# Altium project AUDIO_FM_LC_00.PrjPcb
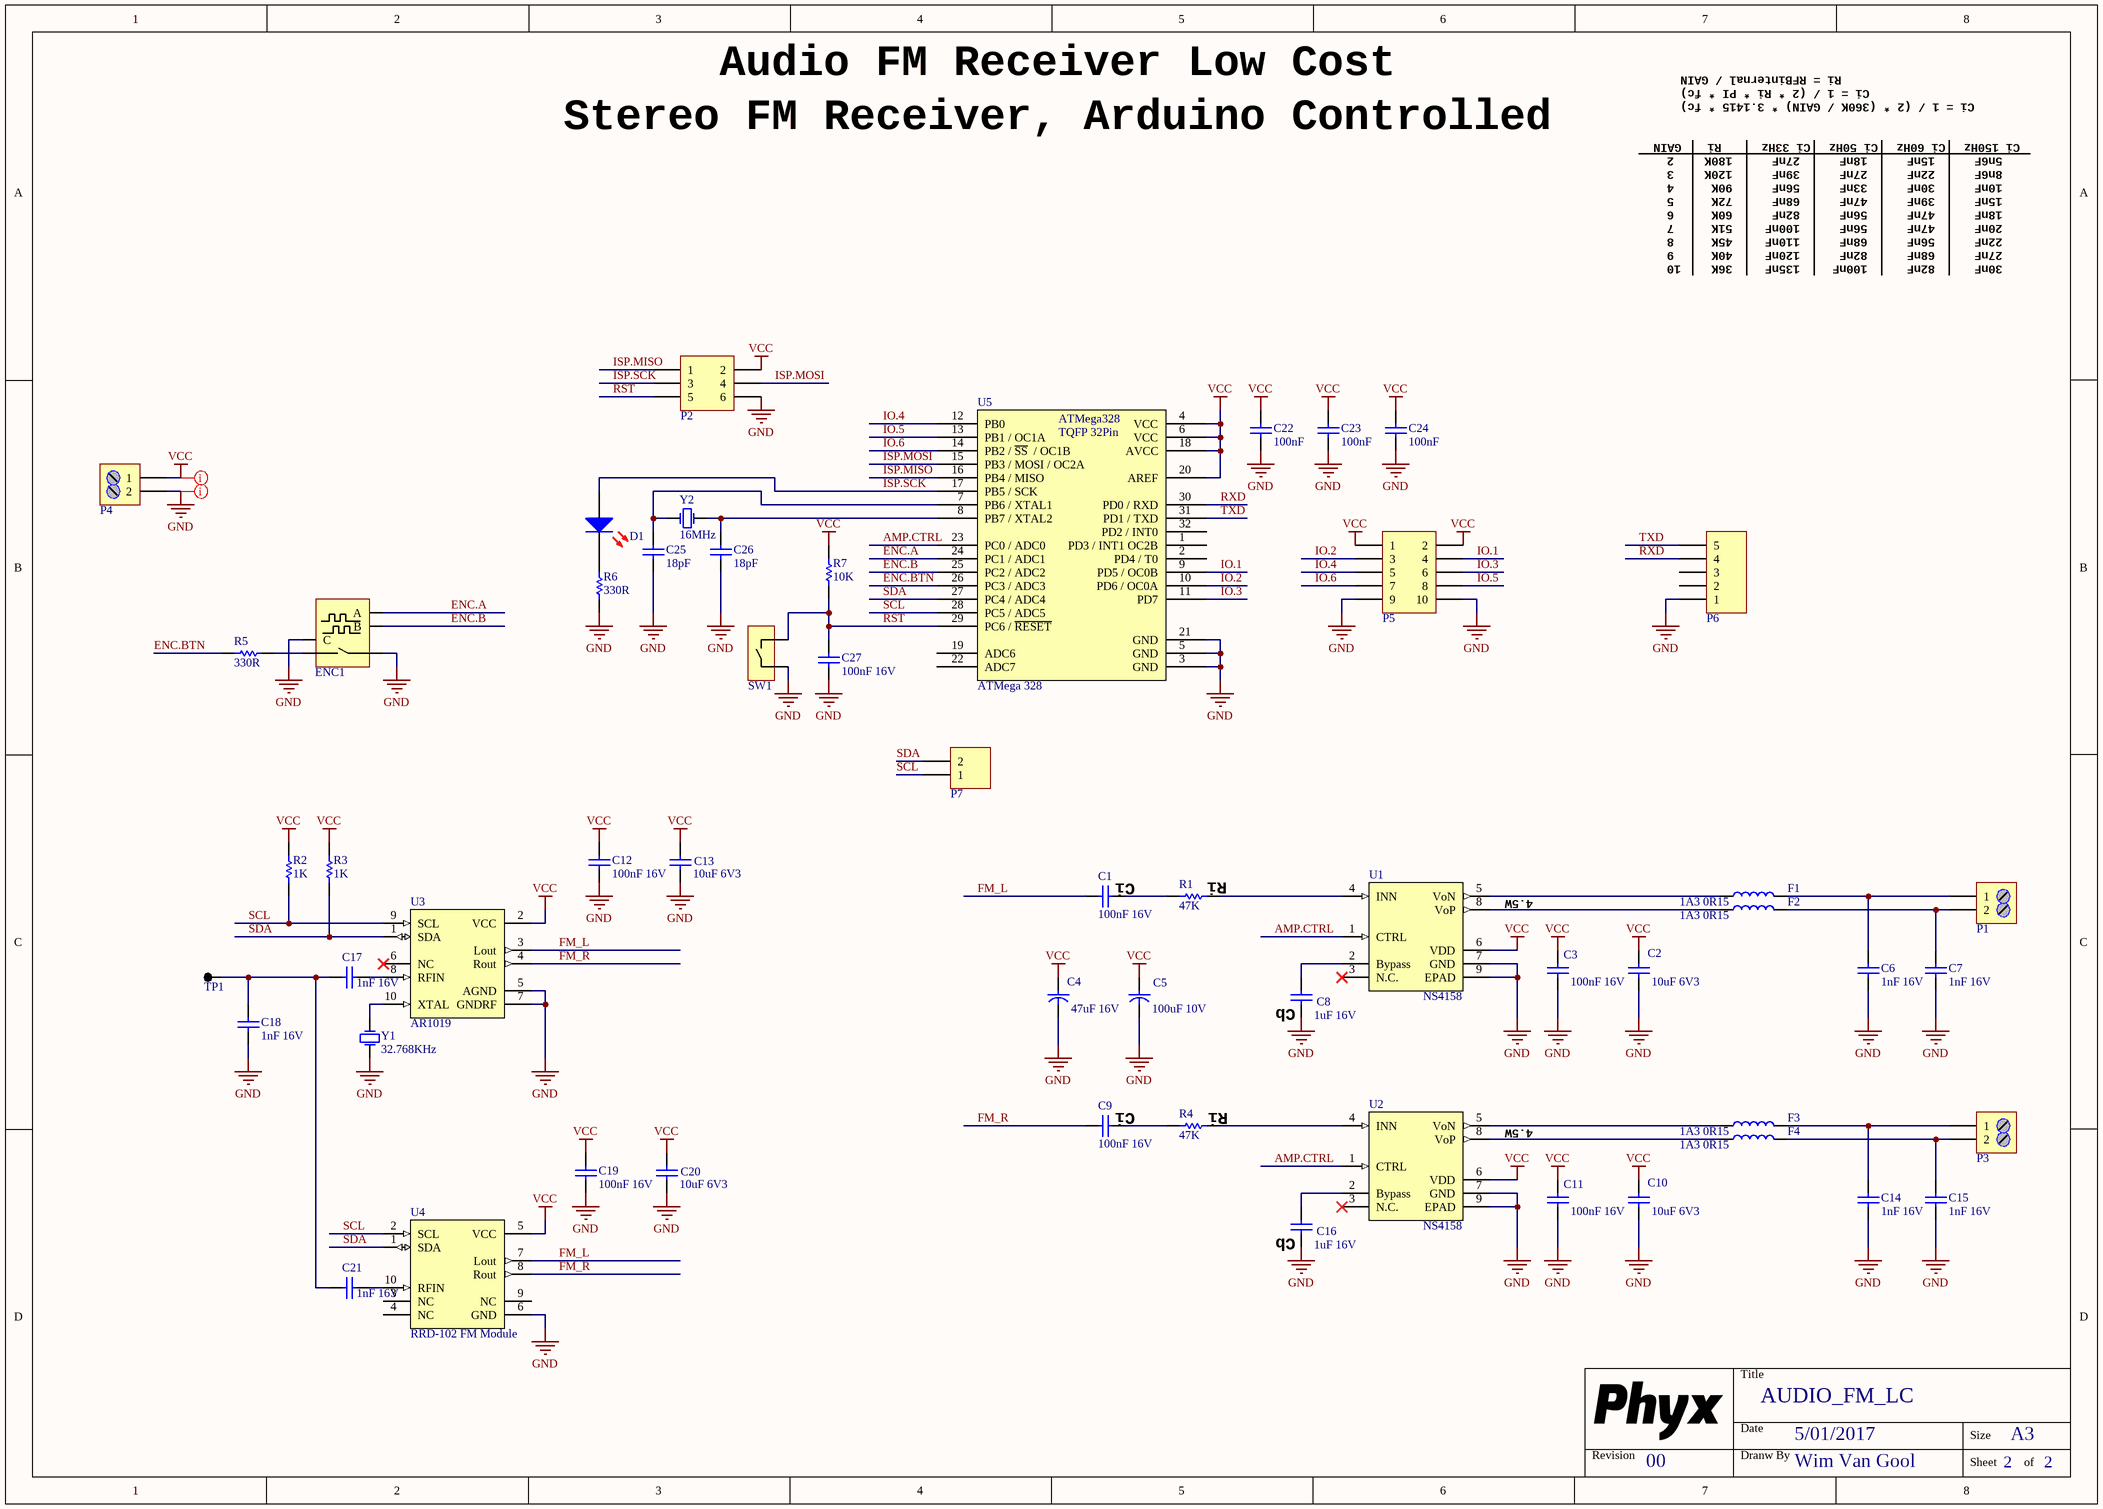
[diagram p0: AUDIO_FM_LC_00.SchDoc]
PCB_ENGINEER: WimVG; PCB_REV: 00; PCB_TITLE: AUDIO_FM_LC
1 sheet, 56 parts. Net scope: global (net labels, ports and power ports of the same name join across sheets).
Board file: AUDIO_FM_LC_00.PcbDoc

## Sheet AUDIO_FM_LC_00.SchDoc: AUDIO_FM_LC
size A3; Date: 5/01/2017; DrawnBy: Wim Van Gool; Revision: 00; SheetNumber: 2; SheetTotal: 2; PageSetup: Record=PageOptions|CenterHorizontal=True|CenterVertical=True|PrintScale=0.70|XCorrection=1.00|YCorrection=1.00|PrintKind=1|BorderSize=5000000|LeftOffset=0|BottomOffset=0|Orientation=2|PaperLength=1000|PaperWidth=1000|Scale=100|PaperSource=15|PrintQuality=600|MediaType=1|DitherType=10|PrintScaleMode=1|PaperKind=A4 (210 x 297 mm)|PaperIndex=9

### Parts
C1  value 100nF 16V  [C0603_N]  (hidden comment: CAP_CERAMIC)
C2  value 10uF 6V3  [C0805_N]  (hidden comment: CAP_CERAMIC)
C3  value 100nF 16V  [C0603_N]  (hidden comment: CAP_CERAMIC)
C4  value 47uF 16V  [C6.6x5.4]  (hidden comment: CAP_POL)
C5  value 100uF 10V  [C_5x11_2mm]  (hidden comment: CAP_POL)
C6  value 1nF 16V  [C0603_N]  (hidden comment: CAP_CERAMIC)
C7  value 1nF 16V  [C0603_N]  (hidden comment: CAP_CERAMIC)
C8  value 1uF 16V  [C0805_N]  (hidden comment: CAP_CERAMIC)
C9  value 100nF 16V  [C0603_N]  (hidden comment: CAP_CERAMIC)
C10  value 10uF 6V3  [C0805_N]  (hidden comment: CAP_CERAMIC)
C11  value 100nF 16V  [C0603_N]  (hidden comment: CAP_CERAMIC)
C12  value 100nF 16V  [C0603_N]  (hidden comment: CAP_CERAMIC)
C13  value 10uF 6V3  [C0805_N]  (hidden comment: CAP_CERAMIC)
C14  value 1nF 16V  [C0603_N]  (hidden comment: CAP_CERAMIC)
C15  value 1nF 16V  [C0603_N]  (hidden comment: CAP_CERAMIC)
C16  value 1uF 16V  [C0805_N]  (hidden comment: CAP_CERAMIC)
C17  value 1nF 16V  [C0603_N]  (hidden comment: CAP_CERAMIC)
C18  value 1nF 16V  [C0603_N]  (hidden comment: CAP_CERAMIC)
C19  value 100nF 16V  [C0603_N]  (hidden comment: CAP_CERAMIC)
C20  value 10uF 6V3  [C0805_N]  (hidden comment: CAP_CERAMIC)
C21  value 1nF 16V  [C0603_N]  (hidden comment: CAP_CERAMIC)
C22  value 100nF  [C0603_N]  (hidden comment: CAP_CERAMIC)
C23  value 100nF  [C0603_N]  (hidden comment: CAP_CERAMIC)
C24  value 100nF  [C0603_N]  (hidden comment: CAP_CERAMIC)
C25  value 18pF  [C0603_N]  (hidden comment: CAP_CERAMIC)
C26  value 18pF  [C0603_N]  (hidden comment: CAP_CERAMIC)
C27  value 100nF 16V  [C0603_N]  (hidden comment: CAP_CERAMIC)
D1  Default 0805 Red LED  [LED_0805_RD]  (value not drawn)
ENC1  Rotary Encoder with Switch  [PEC11-4215F-S0024]  (value not drawn)
F1  value 1A3 0R15  [L0603]  (hidden comment: BLM18KG601SN1D)
F2  value 1A3 0R15  [L0603]  (hidden comment: BLM18KG601SN1D)
F3  value 1A3 0R15  [L0603]  (hidden comment: BLM18KG601SN1D)
F4  value 1A3 0R15  [L0603]  (hidden comment: BLM18KG601SN1D)
P1  2 Way Screw HDR 3,5mm  [WE_691103110002]  (value not drawn)
P2  Header 3X2  [HDR2X3]  (value not drawn)
P3  2 Way Screw HDR 3,5mm  [WE_691103110002]  (value not drawn)
P4  2 Way Screw HDR 3,5mm  [WE_691103110002]  (value not drawn)
P5  Header 5x2  [HDR2X5]  (value not drawn)
P6  Header 5  [HDR1X5]  (value not drawn)
P7  Header 2  [HDR1X2]  (value not drawn)
R1  value 47K  [R0603_N]  (hidden comment: RESISTOR)
R2  value 1K  [R0603_N]  (hidden comment: RESISTOR)
R3  value 1K  [R0603_N]  (hidden comment: RESISTOR)
R4  value 47K  [R0603_N]  (hidden comment: RESISTOR)
R5  value 330R  [R0603_N]  (hidden comment: RESISTOR)
R6  value 330R  [R0603_N]  (hidden comment: RESISTOR)
R7  value 10K  [R0603_N]  (hidden comment: RESISTOR)
SW1  Default TH TACT  [TACTSW]  (value not drawn)
TP1  TEST_PAD  [TP_1.5mm_0.9mm]  (value not drawn)
U1  value NS4158  [SOIC_N_8_TH]  (hidden comment: 5W Class D mono amplifier inducter-less)
U2  value NS4158  [SOIC_N_8_TH]  (hidden comment: 5W Class D mono amplifier inducter-less)
U3  value AR1019  [TI_DGS_S-PDSO-G10]  (hidden comment: FM Receiver I2C)
U4  value RRD-102 FM Module  [RRD-102]  (hidden comment: RRD-102 V2.0 FM Radio Module With RDS decoding)
U5  value ATMega 328  [TQFP_32]  (hidden comment: 8-bit MCU)
Y1  value 32.768KHz  [CMR200T]  (hidden comment: 32.768Khz CMR200 12.5pF)
Y2  value 16MHz  [HC49US]  (hidden comment: 16MHz 18pF HC49US)

### Nets
GND: C2.2 C3.2 C4.2 C5.2 C6.2 C7.2 C8.2 C10.2 C11.2 C12.2 C13.2 C14.2 C15.2 C16.2 C18.2 C19.2 C20.2 C22.2 C23.2 C24.2 C25.2 C26.2 C27.2 ENC1.2 ENC1.C P2.6 P4.2 P5.9 P5.10 P6.1 R6.2 SW1.2 U1.7(GND) U1.9(EPAD) U2.7(GND) U2.9(EPAD) U3.5(AGND) U3.7(GNDRF) U4.6(GND) U5.3(GND) U5.5(GND) U5.21(GND) Y1.2(OSC2)
VCC: C2.1 C3.1 C4.1 C5.1 C10.1 C11.1 C12.1 C13.1 C19.1 C20.1 C22.1 C23.1 C24.1 P2.2 P4.1 P5.1 P5.2 R2.1 R3.1 R7.1 U1.6(VDD) U2.6(VDD) U3.2(VCC) U4.5(VCC) U5.4(VCC) U5.6(VCC) U5.18(AVCC) U5.20(AREF)
AMP.CTRL: U1.1(CTRL) U2.1(CTRL) U5.23(PC0_/_ADC0)
ENC.A: ENC1.A U5.24(PC1_/_ADC1)
ENC.B: ENC1.B U5.25(PC2_/_ADC2)
ENC.BTN: R5.1 U5.26(PC3_/_ADC3)
FM_L: C1.1 U3.3(Lout) U4.7(Lout)
FM_R: C9.1 U3.4(Rout) U4.8(Rout)
IO.1: P5.4 U5.9(PD5_/_OC0B)
IO.2: P5.3 U5.10(PD6_/_OC0A)
IO.3: P5.6 U5.11(PD7)
IO.4: P5.5 U5.12(PB0)
IO.5: P5.8 U5.13(PB1_/_OC1A)
IO.6: P5.7 U5.14(PB2_/_~{SS}__/_OC1B)
ISP.MISO: P2.1 U5.16(PB4_/_MISO)
ISP.MOSI: P2.4 U5.15(PB3_/_MOSI_/_OC2A)
ISP.SCK: D1.1(A) P2.3 U5.17(PB5_/_SCK)
RST: C27.1 P2.5 R7.2 SW1.1 U5.29(PC6_/_~{RESET})
RXD: P6.4 U5.30(PD0_/_RXD)
SCL: P7.1 R2.2 U3.9(SCL) U4.2(SCL) U5.28(PC5_/_ADC5)
SDA: P7.2 R3.2 U3.1(SDA) U4.1(SDA) U5.27(PC4_/_ADC4)
TXD: P6.5 U5.31(PD1_/_TXD)
NetC1_2: C1.2 R1.2
NetC6_1: C6.1 F1.2 P1.1
NetC7_1: C7.1 F2.2 P1.2
NetC8_1: C8.1 U1.2(Bypass)
NetC9_2: C9.2 R4.2
NetC14_1: C14.1 F3.2 P3.1
NetC15_1: C15.1 F4.2 P3.2
NetC16_1: C16.1 U2.2(Bypass)
NetC17_1: C17.1 U3.8(RFIN)
NetC17_2: C17.2 C18.1 C21.2 TP1.1
NetC21_1: C21.1 U4.10(RFIN)
NetC25_1: C25.1 U5.7(PB6_/_XTAL1) Y2.1(OSC1)
NetC26_1: C26.1 U5.8(PB7_/_XTAL2) Y2.2(OSC2)
NetD1_2: D1.2(K) R6.1
NetENC1_1: ENC1.1 R5.2
NetF1_1: F1.1 U1.5(VoN)
NetF2_1: F2.1 U1.8(VoP)
NetF3_1: F3.1 U2.5(VoN)
NetF4_1: F4.1 U2.8(VoP)
NetR1_1: R1.1 U1.4(INN)
NetR4_1: R4.1 U2.4(INN)
NetU3_10: U3.10(XTAL) Y1.1(OSC1)

Not connected (* = marked no-connect by the designer): P6 2 3; U1 3(N.C.)*; U2 3(N.C.)*; U3 6(NC)*; U4 3(NC) 4(NC) 9(NC); U5 1(PD3_/_INT1_OC2B) 2(PD4_/_T0) 19(ADC6) 22(ADC7) 32(PD2_/_INT0)

### Layout directives
net class POWER: GND, VCC

### Notes on the sheet
- Audio FM Receiver Low Cost
- Ci = 1 / (2 * Ri * PI * fc)
- Ci = 1 / (2 * (360K / GAIN) * 3.1415 * fc)
- Ri = RFBinternal / GAIN
- Stereo FM Receiver, Arduino Controlled
- GAIN
- 2
- 3
- 4
- Ri
- 180K
- 120K
- 90K
- Ci 33Hz
- 27nF
- 39nF
- 56nF
- Ci 50Hz
- 18nF
- 33nF
- Ci 60Hz
- 15nF
- 22nF
- 30nF
- Ci 150Hz
- 5n6F
- 8n6F
- 10nF
- 5
- 6
- 7
- 8
- 9
- 72K
- 60K
- 51K
- 45K
- 40K
- 68nF
- 82nF
- 100nF
- 110nF
- 120nF
- 47nF
- 20nF
- 10
- 36K
- 135nF
- (near C1) Ci
- (near R1) Ri
- 4.5W
- (near C8) Cb
- (near C9) Ci
- (near R4) Ri
- (near C16) Cb
- Title
- Revision
- Date
- Dranw By
- Size
- A3
- Sheet
- of
- (in symbol AVR # ATMega 328 MCU TQFP) ATMega328; TQFP 32Pin

### Library data of the parts
C1 C3 C9 C11 C12 C19 C22-C24 C27 = CAP # 100nF 16V 0603: Capacitor Ceramic
C2 C10 C13 C20 = CAP # 10uF 6V3 0805: Capacitor Ceramic; Supplier 1: Farnell; Supplier Part Number 1: 2309029
C4 = CAP # 47uF 16V 6.3x5.2mm: Capacitor electrolyt; Supplier 1: Farnell; Supplier Part Number 1: 9265694
C5 = CAP 100uF 10V 5x11mm: Capacitor electrolyt; Supplier 1: Farnell; Supplier Part Number 1: 1902882
C6 C7 C14 C15 C17 C18 C21 = CAP # 1nF 16V 0603: Capacitor Ceramic
C8 C16 = CAP # 1uF 16V 0805: Capacitor Ceramic; Supplier 1: Farnell; Supplier Part Number 1: 2320853
C25 C26 = CAP # 18pF 0603: Capacitor Ceramic
D1 = LED # Red 0805: =Description; Supplier 1: Farnell; Supplier Part Number 1: 2099236
ENC1 = ENC ROT INC 24-24ppr SW: Value: PEC11-4215F-S0024; Supplier 1: Farnell
F1-F4 = FER # 600R 1A3 0603 0R15 BLM18KG601SN1D: Supplier 1: Farnell; Supplier Part Number 1: 1781094
P1 P3 P4 = Terminal Block 3,5mm 2way - 691103110002: Value: 691103110002; Supplier 1: Wurth
P2 = Pin Header 2.54mm dual row 6way
P5 = Pin Header 2.54mm dual row 10way
P6 = Pin Header 2.54mm 5way
P7 = Pin Header 2.54mm 2way: Description: Pin Header 2.54mm 2way
R1 R4 = RES # 47K 0603
R2 R3 = RES # 1K 0603
R5 R6 = RES # 330R 0603: Supplier 1: Farnell; Supplier Part Number 1: 2446656
R7 = RES # 10K 0603: Supplier 1: Farnell; Supplier Part Number 1: 2502397
SW1 = SW TACT: Description: SW TACT
TP1 = TP 1.5mm: Value: NO BOM
U1 U2 = AMP # AUDIO NS4158: =Description; Supplier 1: Aliexpress; Supplier Part Number 1: NS4158
U3 = FM # AR1019: =Description; Supplier 1: Aliexpress; Supplier Part Number 1: AR1019
U4 = FM # MOD RRD-102: =Description; Supplier 1: Aliexpress; Supplier Part Number 1: RRD-102
U5 = AVR # ATMega 328 MCU TQFP: ATMega328 SMD TQFP
Y1 = XTAL # 32.768Khz 12.5pF CMR200: Crystal Oscillator; Supplier 1: Farnell; Supplier Part Number 1: 2101359
Y2 = XTAL 16Mhz HC49US: Crystal Oscillator; Supplier 1: Farnell; Supplier Part Number 1: 2508458

## Assembly variants
LOW_COST: not fitted C4